# Altium schematic sheet Outgoing_Connector_4.SchDoc
size A4
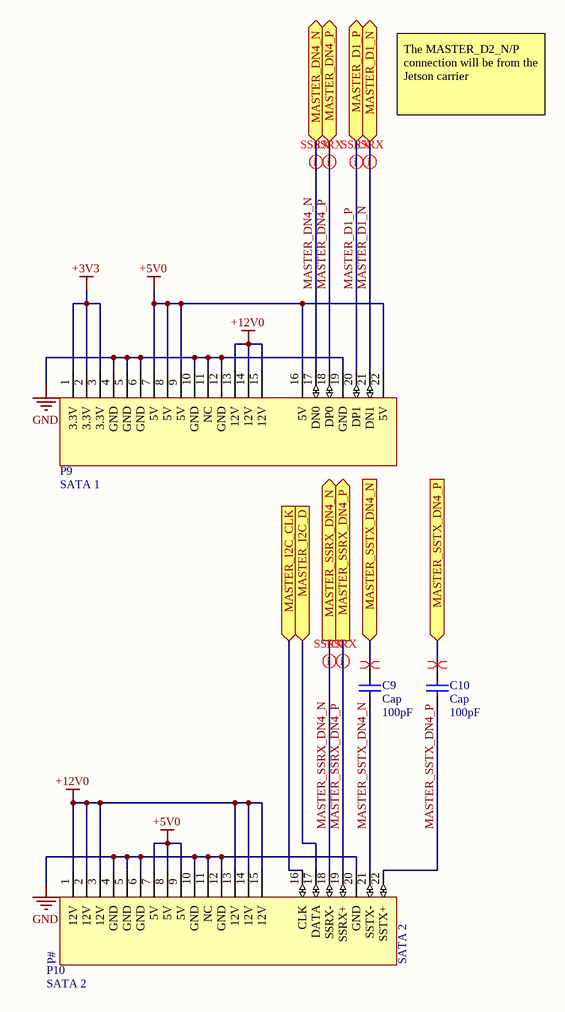
[diagram p0: Outgoing_Connector_4.SchDoc]

## Parts
C9  Cap  value 100pF  [RAD-0.3]
C10  Cap  value 100pF  [RAD-0.3]
P9  SATA 1  [Amphenol 10017660-001LF]
P10  SATA 2  [Amphenol 10017660-001LF]

## Ports
MASTER_D1_N (bidir), MASTER_D1_P (bidir), MASTER_DN4_N (bidir), MASTER_DN4_P (bidir), MASTER_I2C_CLK (in), MASTER_I2C_D (in), MASTER_SSRX_DN4_N (out), MASTER_SSRX_DN4_P (out), MASTER_SSTX_DN4_N (in), MASTER_SSTX_DN4_P (in)

## Nets
+3V3: P9.1(3.3V) P9.2(3.3V) P9.3(3.3V)
+5V0: P9.7(5V) P9.8(5V) P9.9(5V) P9.16(5V) P9.22(5V) P10.7(5V) P10.8(5V) P10.9(5V)
+12V0: P9.13(12V) P9.14(12V) P9.15(12V) P10.1(12V) P10.2(12V) P10.3(12V) P10.13(12V) P10.14(12V) P10.15(12V)
GND: P9.4(GND) P9.5(GND) P9.6(GND) P9.10(GND) P9.11(NC) P9.12(GND) P9.19(GND) P10.4(GND) P10.5(GND) P10.6(GND) P10.10(GND) P10.11(NC) P10.12(GND) P10.20(GND)
MASTER_D1_N: P9.21(DN1) ; port MASTER_D1_N
MASTER_D1_P: P9.20(DP1) ; port MASTER_D1_P
MASTER_DN4_N: P9.17(DN0) ; port MASTER_DN4_N
MASTER_DN4_P: P9.18(DP0) ; port MASTER_DN4_P
MASTER_I2C_CLK: P10.16(CLK) ; port MASTER_I2C_CLK
MASTER_I2C_D: P10.17(DATA) ; port MASTER_I2C_D
MASTER_SSRX_DN4_N: P10.18(SSRX-) ; port MASTER_SSRX_DN4_N
MASTER_SSRX_DN4_P: P10.19(SSRX+) ; port MASTER_SSRX_DN4_P
MASTER_SSTX_DN4_N: C9.1 P10.21(SSTX-)
MASTER_SSTX_DN4_N: C9.2 ; port MASTER_SSTX_DN4_N  [a separate net that carries the same name]
MASTER_SSTX_DN4_P: C10.1 P10.22(SSTX+)
MASTER_SSTX_DN4_P: C10.2 ; port MASTER_SSTX_DN4_P  [a separate net that carries the same name]

## Layout directives
differential pair; rule Signal Stimulus [Kind - Single Pulse    Level - High    Start Time = 0.000    Stop Time = 200.0p    Period Time = 400.0p]: (no net found under the mark), MASTER_D1_N, MASTER_D1_P, MASTER_DN4_N, MASTER_DN4_P, MASTER_SSRX_DN4_N, MASTER_SSRX_DN4_P

## Notes on the sheet
- The MASTER_D2_N/P connection will be from the Jetson carrier
- (in symbol SATA 2) P#

## Library data of the parts
C9 C10 = Cap: Capacitor; Published: 8-Jun-2000; LatestRevisionDate: 17-Jul-2002; LatestRevisionNote: Re-released for DXP Platform.; PackageReference: RAD-0.3; Publisher: Altium Limited; PackageDescription: Radial Cap, Thru-Hole; 2 Leads; 0.3 in Pin Spacing
P9 = SATA 1: SATA connector. / Connector 1 for option 1 as per Spec; Supplier 1: Digi-Key
P10 = SATA 2: SATA connector. / Connector 2 for option 1 as per Spec; Supplier 1: Digi-Key